# Altium schematic sheet Raspberry Pi CM4_Periphery.SchDoc
size A3; SheetNumber: 24; SheetTotal: 32
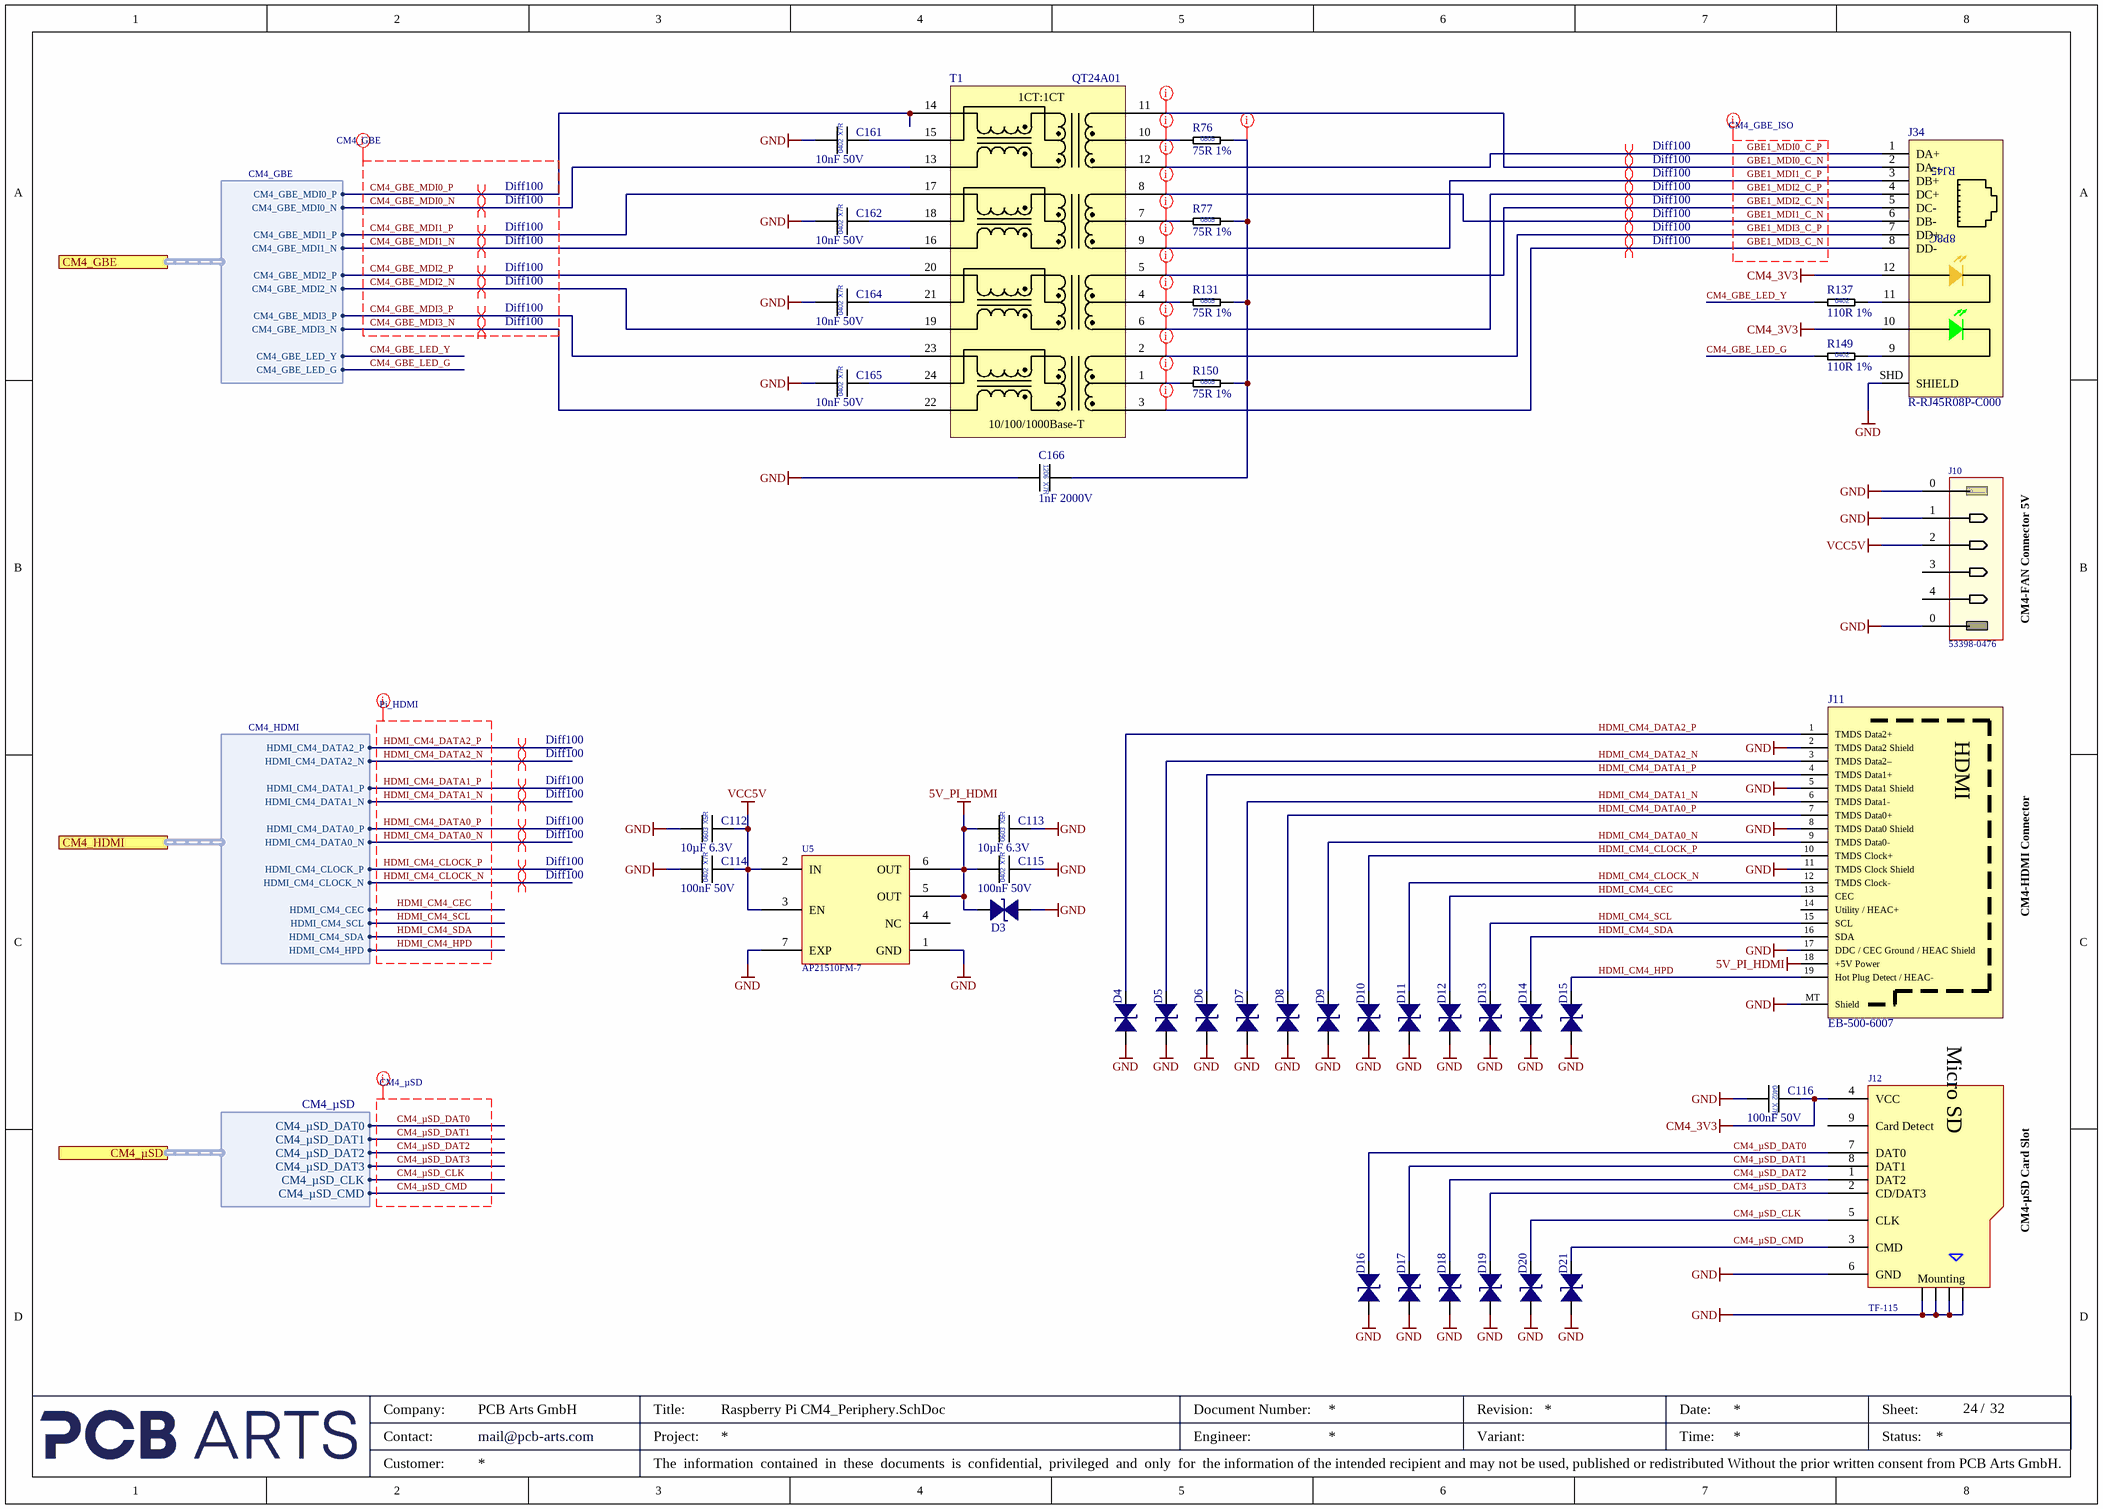
[diagram p0: Raspberry Pi CM4_Periphery.SchDoc]

## Parts
C112  10µF 6.3V  [CAP_0603_L]
C113  10µF 6.3V  [CAP_0603_L]
C114  100nF 50V  [CAP_0402_L]
C115  100nF 50V  [CAP_0402_L]
C116  100nF 50V  [CAP_0402_L]
C161  10nF 50V  [CAP_0402_L]
C162  10nF 50V  [CAP_0402_L]
C164  10nF 50V  [CAP_0402_L]
C165  10nF 50V  [CAP_0402_L]
C166  1nF 2000V  [CAP_1206]
D3  CESDP0402UC5VB  [TVS_0402]  (value not drawn)
D4  CESDP0402UC5VB  [TVS_0402]  (value not drawn)
D5  CESDP0402UC5VB  [TVS_0402]  (value not drawn)
D6  CESDP0402UC5VB  [TVS_0402]  (value not drawn)
D7  CESDP0402UC5VB  [TVS_0402]  (value not drawn)
D8  CESDP0402UC5VB  [TVS_0402]  (value not drawn)
D9  CESDP0402UC5VB  [TVS_0402]  (value not drawn)
D10  CESDP0402UC5VB  [TVS_0402]  (value not drawn)
D11  CESDP0402UC5VB  [TVS_0402]  (value not drawn)
D12  CESDP0402UC5VB  [TVS_0402]  (value not drawn)
D13  CESDP0402UC5VB  [TVS_0402]  (value not drawn)
D14  CESDP0402UC5VB  [TVS_0402]  (value not drawn)
D15  CESDP0402UC5VB  [TVS_0402]  (value not drawn)
D16  CESDP0402UC5VB  [TVS_0402]  (value not drawn)
D17  CESDP0402UC5VB  [TVS_0402]  (value not drawn)
D18  CESDP0402UC5VB  [TVS_0402]  (value not drawn)
D19  CESDP0402UC5VB  [TVS_0402]  (value not drawn)
D20  CESDP0402UC5VB  [TVS_0402]  (value not drawn)
D21  CESDP0402UC5VB  [TVS_0402]  (value not drawn)
J10  53398-0476  [Molex 53398-0476]
J11  EB-500-6007  [Elecbee EB-500-6007]
J12  TF-115  [TF-115]
J34  R-RJ45R08P-C000  [Ckmtw - R-RJ45R08P-C000]
R76  75R 1%  [RES_0805]
R77  75R 1%  [RES_0805]
R131  75R 1%  [RES_0805]
R137  110R 1%  [RES_0402_L]
R149  110R 1%  [RES_0402_L]
R150  75R 1%  [RES_0805]
T1  QT24A01  [QT24A01]
U5  AP21510FM-7  [QFN50P201X181X60_HS-7N]

## Ports
CM4_GBE (harness CM4_GBE, see Top-Level-Sheet[3C], Raspberry Pi CM4[8A]), CM4_HDMI (harness CM4_HDMI, see Top-Level-Sheet[3C], Raspberry Pi CM4[8B]), CM4_µSD (harness CM4_µSD, see Top-Level-Sheet[3C], Raspberry Pi CM4[8C])

## Harnesses
CM4_GBE: CM4_GBE_MDI0_P, CM4_GBE_MDI0_N, CM4_GBE_MDI1_P, CM4_GBE_MDI1_N, CM4_GBE_MDI2_P, CM4_GBE_MDI2_N, CM4_GBE_MDI3_P, CM4_GBE_MDI3_N, CM4_GBE_LED_Y, CM4_GBE_LED_G
CM4_HDMI: HDMI_CM4_DATA2_P, HDMI_CM4_DATA2_N, HDMI_CM4_DATA1_P, HDMI_CM4_DATA1_N, HDMI_CM4_DATA0_P, HDMI_CM4_DATA0_N, HDMI_CM4_CLOCK_P, HDMI_CM4_CLOCK_N, HDMI_CM4_CEC, HDMI_CM4_SCL, HDMI_CM4_SDA, HDMI_CM4_HPD
CM4_µSD: CM4_µSD_DAT1, CM4_µSD_DAT2, CM4_µSD_DAT3, CM4_µSD_CLK, CM4_µSD_DAT0, CM4_µSD_CMD

## Nets
5V_PI_HDMI: C113.1 C115.1 D3.1 J11.18(+5V_Power) U5.5(OUT) U5.6(OUT)
CM4_3V3: C116.1 J12.4(VCC) J34.10 J34.12
GND: C112.1 C113.2 C114.1 C115.2 C116.2 C161.1 C162.1 C164.1 C165.1 C166.2 D3.2 D4.1 D5.1 D6.1 D7.1 D8.1 D9.1 D10.1 D11.1 D12.1 D13.1 D14.1 D15.1 D16.1 D17.1 D18.1 D19.1 D20.1 D21.1 J10.0 J10.1 J11.2(TMDS_Data2_Shield) J11.5(TMDS_Data1_Shield) J11.8(TMDS_Data0_Shield) J11.11(TMDS_Clock_Shield) J11.17(DDC_/_CEC_Ground_/_HEAC_Shield) J11.MT(Shield) J12.6(GND) J12.10 J12.11 J12.12 J12.13 J34.SHD(SHIELD) U5.1(GND) U5.7(EXP)
VCC5V: C112.2 C114.2 J10.2 U5.2(IN) U5.3(EN)
CM4_GBE_LED_G: R149.1 ; port CM4_GBE.CM4_GBE_LED_G
CM4_GBE_LED_Y: R137.1 ; port CM4_GBE.CM4_GBE_LED_Y
CM4_GBE_MDI0_N: T1.13(MX4-) ; port CM4_GBE.CM4_GBE_MDI0_N
CM4_GBE_MDI0_P: T1.14(MX4+) ; port CM4_GBE.CM4_GBE_MDI0_P
CM4_GBE_MDI1_N: T1.16(MX3-) ; port CM4_GBE.CM4_GBE_MDI1_N
CM4_GBE_MDI1_P: T1.17(MX3+) ; port CM4_GBE.CM4_GBE_MDI1_P
CM4_GBE_MDI2_N: T1.19(MX2-) ; port CM4_GBE.CM4_GBE_MDI2_N
CM4_GBE_MDI2_P: T1.20(MX2+) ; port CM4_GBE.CM4_GBE_MDI2_P
CM4_GBE_MDI3_N: T1.22(MX1-) ; port CM4_GBE.CM4_GBE_MDI3_N
CM4_GBE_MDI3_P: T1.23(MX1+) ; port CM4_GBE.CM4_GBE_MDI3_P
CM4_µSD_CLK: D20.2 J12.5(CLK) ; port CM4_µSD.CM4_µSD_CLK
CM4_µSD_CMD: D21.2 J12.3(CMD) ; port CM4_µSD.CM4_µSD_CMD
CM4_µSD_DAT0: D16.2 J12.7(DAT0) ; port CM4_µSD.CM4_µSD_DAT0
CM4_µSD_DAT1: D17.2 J12.8(DAT1) ; port CM4_µSD.CM4_µSD_DAT1
CM4_µSD_DAT2: D18.2 J12.1(DAT2) ; port CM4_µSD.CM4_µSD_DAT2
CM4_µSD_DAT3: D19.2 J12.2(CD/DAT3) ; port CM4_µSD.CM4_µSD_DAT3
GBE1_MDI0_C_N: J34.2(DA-) T1.11(TD4+)
GBE1_MDI0_C_P: J34.1(DA+) T1.12(TD4-)
GBE1_MDI1_C_N: J34.6(DB-) T1.8(TD3+)
GBE1_MDI1_C_P: J34.3(DB+) T1.9(TD3-)
GBE1_MDI2_C_N: J34.5(DC-) T1.5(TD2+)
GBE1_MDI2_C_P: J34.4(DC+) T1.6(TD2-)
GBE1_MDI3_C_N: J34.8(DD-) T1.3(TD1-)
GBE1_MDI3_C_P: J34.7(DD+) T1.2(TD1+)
HDMI_CM4_CEC: D12.2 J11.13(CEC) ; port CM4_HDMI.HDMI_CM4_CEC
HDMI_CM4_CLOCK_N: D11.2 J11.12(TMDS_Clock-) ; port CM4_HDMI.HDMI_CM4_CLOCK_N
HDMI_CM4_CLOCK_P: D10.2 J11.10(TMDS_Clock+) ; port CM4_HDMI.HDMI_CM4_CLOCK_P
HDMI_CM4_DATA0_N: D9.2 J11.9(TMDS_Data0-) ; port CM4_HDMI.HDMI_CM4_DATA0_N
HDMI_CM4_DATA0_P: D8.2 J11.7(TMDS_Data0+) ; port CM4_HDMI.HDMI_CM4_DATA0_P
HDMI_CM4_DATA1_N: D7.2 J11.6(TMDS_Data1-) ; port CM4_HDMI.HDMI_CM4_DATA1_N
HDMI_CM4_DATA1_P: D6.2 J11.4(TMDS_Data1+) ; port CM4_HDMI.HDMI_CM4_DATA1_P
HDMI_CM4_DATA2_N: D5.2 J11.3(TMDS_Data2–) ; port CM4_HDMI.HDMI_CM4_DATA2_N
HDMI_CM4_DATA2_P: D4.2 J11.1(TMDS_Data2+) ; port CM4_HDMI.HDMI_CM4_DATA2_P
HDMI_CM4_HPD: D15.2 J11.19(Hot_Plug_Detect_/_HEAC-) ; port CM4_HDMI.HDMI_CM4_HPD
HDMI_CM4_SCL: D13.2 J11.15(SCL) ; port CM4_HDMI.HDMI_CM4_SCL
HDMI_CM4_SDA: D14.2 J11.16(SDA) ; port CM4_HDMI.HDMI_CM4_SDA
NetC161_2: C161.2 T1.15(MCT4)
NetC162_2: C162.2 T1.18(MCT3)
NetC164_2: C164.2 T1.21(MCT2)
NetC165_2: C165.2 T1.24(MCT1)
NetC166_1: C166.1 R76.2 R77.2 R131.2 R150.2
NetJ34_9: J34.9 R149.2
NetJ34_11: J34.11 R137.2
NetR76_1: R76.1 T1.10(TCT4)
NetR77_1: R77.1 T1.7(TCT3)
NetR131_1: R131.1 T1.4(TCT2)
NetR150_1: R150.1 T1.1(TCT1)

Not connected (* = marked no-connect by the designer): J10 3 4; J11 14(Utility_/_HEAC+); J12 9(Card_Detect); U5 4(NC)

## Layout directives
net class CM4_GBE: CM4_GBE_MDI0_N, CM4_GBE_MDI0_P, CM4_GBE_MDI1_N, CM4_GBE_MDI1_P, CM4_GBE_MDI2_N, CM4_GBE_MDI2_P, CM4_GBE_MDI3_N, CM4_GBE_MDI3_P
differential pair; net class Diff100: CM4_GBE_MDI0_N, CM4_GBE_MDI0_P, CM4_GBE_MDI1_N, CM4_GBE_MDI1_P, CM4_GBE_MDI2_N, CM4_GBE_MDI2_P, CM4_GBE_MDI3_N, CM4_GBE_MDI3_P, GBE1_MDI0_C_N, GBE1_MDI0_C_P, GBE1_MDI1_C_N, GBE1_MDI1_C_P, GBE1_MDI2_C_N, GBE1_MDI2_C_P, GBE1_MDI3_C_N, GBE1_MDI3_C_P, HDMI_CM4_CLOCK_N, HDMI_CM4_CLOCK_P, HDMI_CM4_DATA0_N, HDMI_CM4_DATA0_P, HDMI_CM4_DATA1_N, HDMI_CM4_DATA1_P, HDMI_CM4_DATA2_N, HDMI_CM4_DATA2_P
net class Pi_HDMI: HDMI_CM4_CEC, HDMI_CM4_CLOCK_N, HDMI_CM4_CLOCK_P, HDMI_CM4_DATA0_N, HDMI_CM4_DATA0_P, HDMI_CM4_DATA1_N, HDMI_CM4_DATA1_P, HDMI_CM4_DATA2_N, HDMI_CM4_DATA2_P, HDMI_CM4_HPD, HDMI_CM4_SCL, HDMI_CM4_SDA
net class CM4_µSD: CM4_µSD_CLK, CM4_µSD_CMD, CM4_µSD_DAT0, CM4_µSD_DAT1, CM4_µSD_DAT2, CM4_µSD_DAT3
net class CM4_GBE_ISO: GBE1_MDI0_C_N, GBE1_MDI0_C_P, GBE1_MDI1_C_N, GBE1_MDI1_C_P, GBE1_MDI2_C_N, GBE1_MDI2_C_P, GBE1_MDI3_C_N, GBE1_MDI3_C_P, NetC166_1, NetR76_1, NetR77_1, NetR131_1, NetR150_1

## Notes on the sheet
- CM4-FAN Connector 5V
- CM4-HDMI Connector
- CM4-µSD Card Slot
- Company:
- Contact:
- Customer:
- mail@pcb-arts.com
- PCB Arts GmbH
- Title:
- Project:
- The  information  contained  in  these  documents  is  confidential,  privileged  and  only  for  the information of the intended recipient and may not be used, published or redistributed Without the prior written consent from PCB Arts GmbH.
- Engineer:
- Document Number:
- Revision:
- Variant:
- Date:
- Time:
- Sheet:
- Status:
- /
- (in symbol CAP_0402_10nF_50V) X7R; 0402
- (in symbol CAP_0402_100nF_50V) X7R; 0402
- (in symbol CAP_0603_10µF_6.3V) X5R; 0603
- (in symbol CAP_1206_1nF_2000V) 1206; X7R
- (in symbol EB-500-6007_HDMI Connector 19Pin Vertical THT) HDMI
- (in symbol QT24A01_10/100/1000Base-T  Single  Port  Transformer) 1CT:1CT; 10/100/1000Base-T
- (in symbol R-RJ45R08P-C000_RJ45 8P8C Shielded Yellow - Green Through Hole Ethernet Connectors) RJ45; 8P8C
- (in symbol RES_0402_110R_1%) 0402
- (in symbol RES_0805_75R_1%) 0805
- (in symbol TF-115_microSD™ Memory Card 8 connector) Micro SD; Mounting

## Library data of the parts
C112 C113 = CAP_0603_10µF_6.3V: Multilayer Ceramic Capacitors MLCC - SMD/SMT 0603 6.3VDC; Manufacturer 1: Murata Electronics; Manufacturer 1 Prt. Nr.: GRM188R60J106ME84J; Manufacturer 2 Prt. Nr.: JMK107ABJ106MA-T; Manufacturer 2: Taiyo Yuden
C114-C116 = CAP_0402_100nF_50V: Multilayer Ceramic Capacitors MLCC - SMD/SMT 0402 50VDC; Manufacturer 1: Murata Electronics; Manufacturer 1 Prt. Nr.: GCM155L8EH104KE07D; Manufacturer 2 Prt. Nr.: UMK105B7104KV-FR; Manufacturer 2: TDK
C161 C162 C164 C165 = CAP_0402_10nF_50V: Multilayer Ceramic Capacitors MLCC - SMD/SMT 0402 50VDC; Manufacturer 1: Wurth Elektronik; Manufacturer 1 Prt. Nr.: 885012205067; Manufacturer 2 Prt. Nr.: AC0402KPX7R9BB103; Manufacturer 2: Yageo
C166 = CAP_1206_1nF_2000V: Multilayer Ceramic Capacitors MLCC - SMD/SMT 1206 2000VDC; Manufacturer 1: Yageo; Manufacturer 1 Prt. Nr.: CC1206MKX7RDBB102; Manufacturer 2 Prt. Nr.: 1206B102M202CT; Manufacturer 2: Walsin
D3-D21 = CESDP0402UC5VB_TVS Diode 0402: Low Capacitance ESD Protection Diode 0402; Manufacturer 1: CREATEK; Manufacturer 2 Prt. Nr.: BPESD0402-05ST; Manufacturer 1 Prt. Nr.: CESDP0402UC5VB; Manufacturer 2: BORN
J10 = 53398-0476_1.25mm Pitch, PicoBlade PCB Header, Single Row, horizontal, SMD, 4 Pin: 1.25mm Pitch, PicoBlade PCB Header, Single Row, horizontal, SMD, 4 Pin; Manufacturer 1: Molex; Manufacturer 2 Prt. Nr.: 53398-0471; Manufacturer 1 Prt. Nr.: 53398-0476; Manufacturer 2: Molex
J11 = EB-500-6007_HDMI Connector 19Pin Vertical THT: HDMI Connector Female Vertical 19 Pin; Manufacturer 1: Elecbee; Manufacturer 1 Prt. Nr.: EB-500-6007
J12 = TF-115_microSD™ Memory Card 8 connector: microSD™ Memory Card 8 connector&Ejector 14.5x14.75x1.85mm Card Sockets Connector; Manufacturer 1: XUNPU; Manufacturer 1 Prt. Nr.: TF-115
J34 = R-RJ45R08P-C000_RJ45 8P8C Shielded Yellow - Green Through Hole Ethernet Connectors: RJ45 8 1 Shielded Yellow - Green Through Hole Ethernet Connectors/Modular Connectors (RJ45 RJ11) RoHS; Manufacturer 1: Ckmtw(Shenzhen Cankemeng); Manufacturer 1 Prt. Nr.: R-RJ45R08P-C000
R76 R77 R131 R150 = RES_0805_75R_1%: Thick Film Resistors - SMD 75Ohm 1%; Manufacturer 1: Bourns; Manufacturer 1 Prt. Nr.: CR0805-FX-75R0ELF; Manufacturer 2 Prt. Nr.: ERJ-6ENF75R0V; Manufacturer 2: Panasonic
R137 R149 = RES_0402_110R_1%: Thick Film Resistors - SMD 110Ohm 1%; Manufacturer 1: Vishay / Dale; Manufacturer 1 Prt. Nr.: CRCW0402110RFKTD; Manufacturer 2 Prt. Nr.: RC0402FR-7W110RL; Manufacturer 2: Yageo
T1 = QT24A01_10/100/1000Base-T  Single  Port  Transformer: 1:1 350 28 1.2 -1 -16 SMD,24PIN RJ45 Transformer RoHS; Manufacturer 1: TNK; Manufacturer 1 Prt. Nr.: QT24A01
U5 = AP21510FM-7_Power Switch ICs - Power Distribution Load Switch: Power Switch ICs - Power Distribution 0.5A SGL Ch USB 2.0 Curr Limited Switch; Manufacturer 1: Diodes Incorporated; Manufacturer 1 Prt. Nr.: AP21510FM-7